# EAGLE design theWeather_A (EAGLE 5.11)

## Sheet 1 of 2
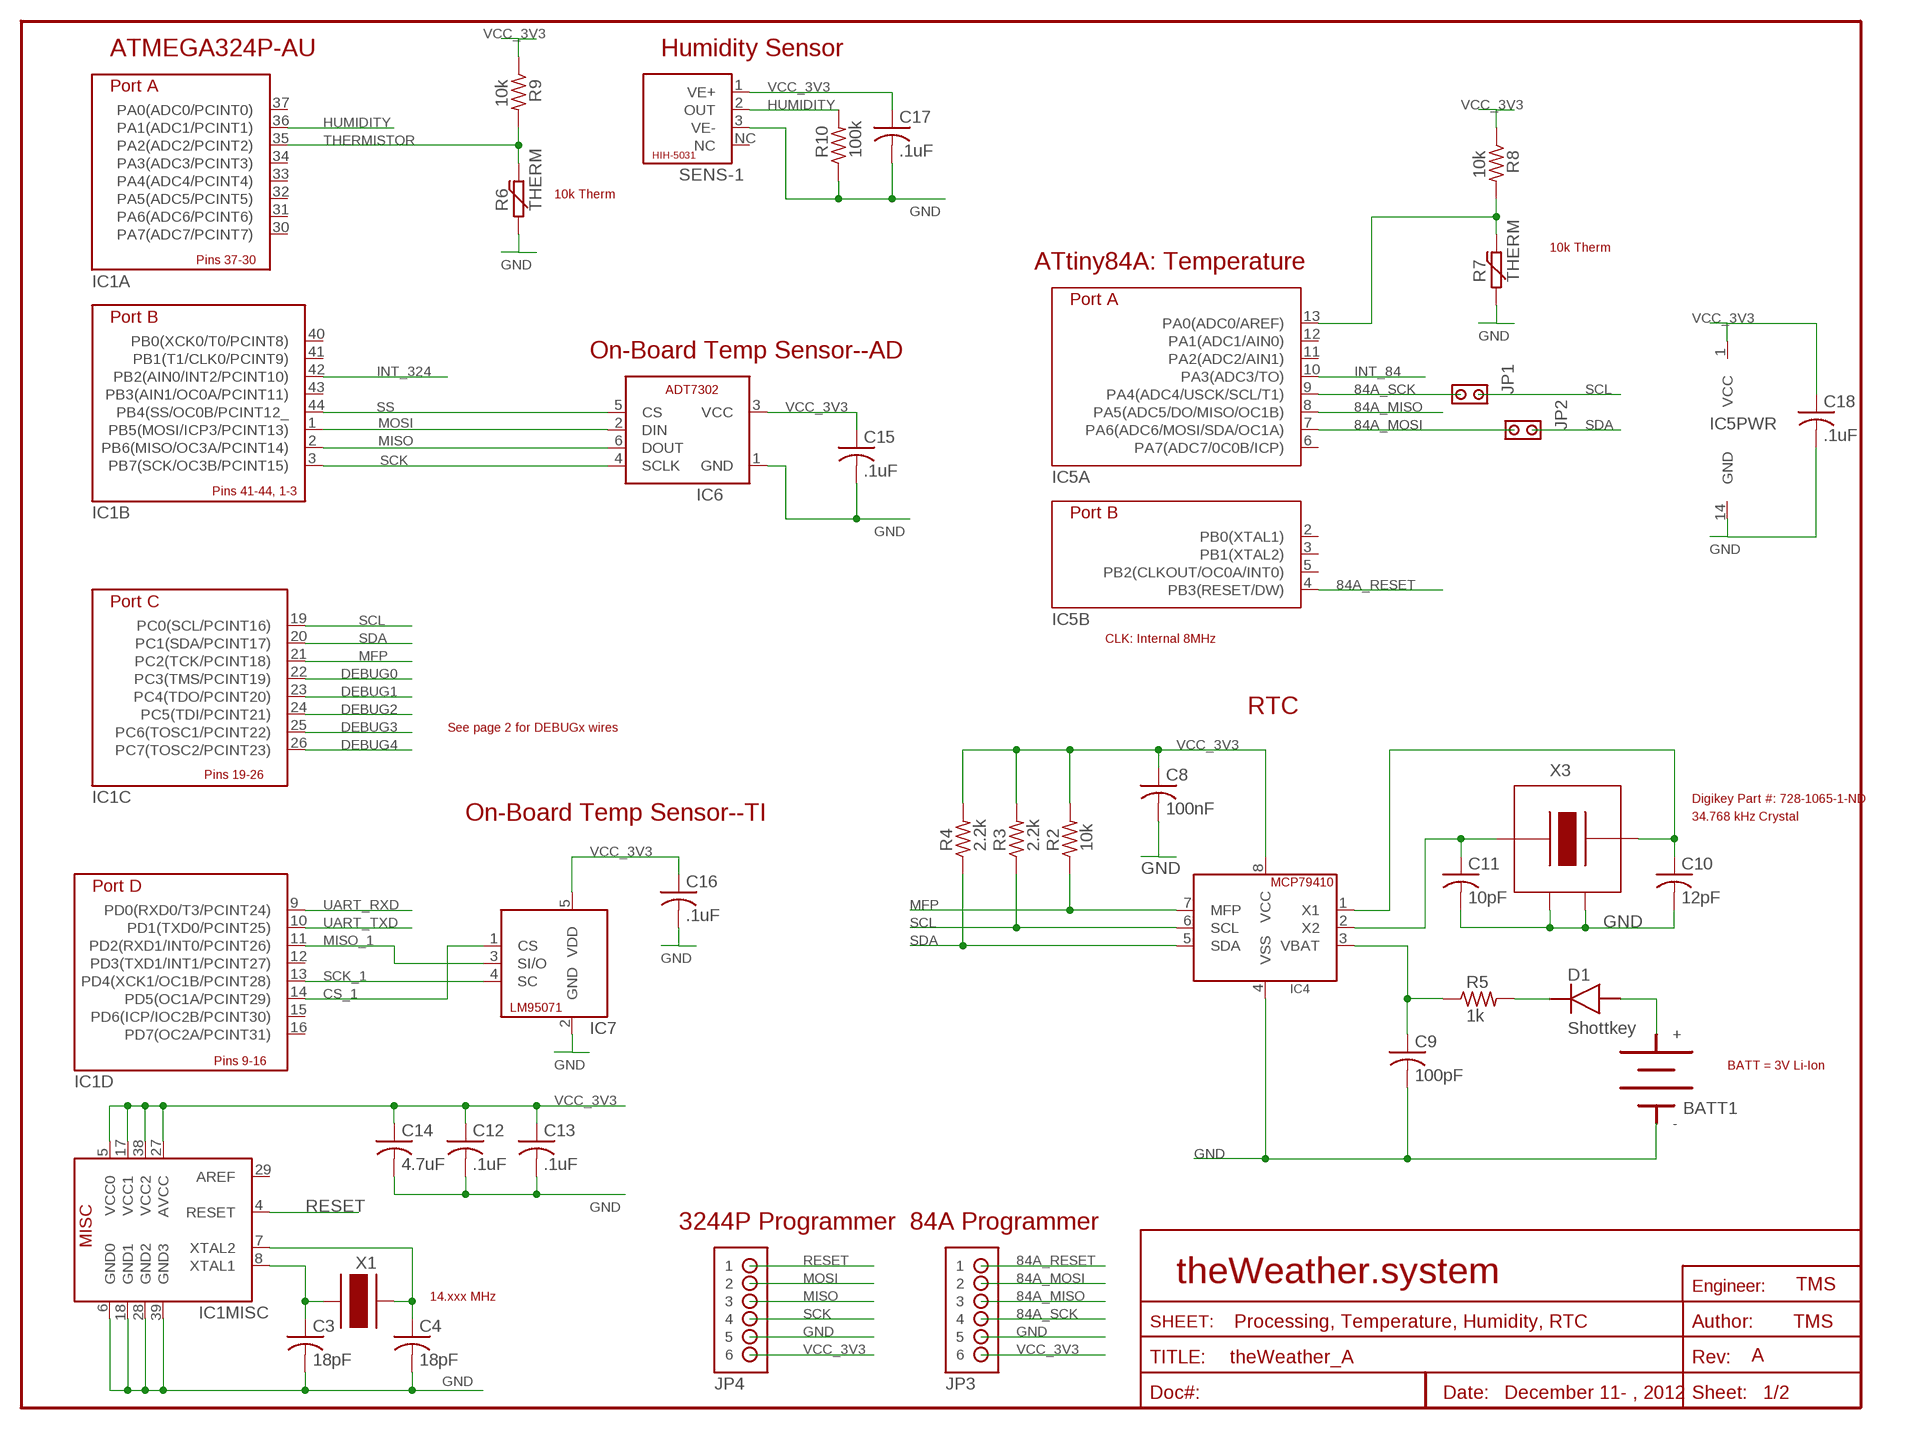
[diagram p0: schematic, sheet 1]

### Parts
BATT1  COINCELL-BR-1632A  [BR-1632A]
C3  18pF  CAP-S0805S  [C0805S]
C4  18pF  CAP-S0805S  [C0805S]
C8  100nF  CAP-S0603S  [C0603S]
C9  100pF  CAP-S0603  [C0603]
C10  12pF  CAP-S0603  [C0603]
C11  10pF  CAP-S0603  [C0603]
C12  .1uF  CAP-S0402  [C0402]
C13  .1uF  CAP-S0402  [C0402]
C14  4.7uF  CAP-S0603S  [C0603S]
C15  .1uF  CAP-S0402  [C0402]
C16  .1uF  CAP-S0402  [C0402]
C17  .1uF  CAP-S0402  [C0402]
C18  .1uF  CAP-S0402  [C0402]
D1  Shottkey  DIODE-DO-214AA  [DO-214AA]
IC1  ATMEGA1284P-AU  [TQFP44]
IC4  MCP79410-SOIC8  [SOIC8]
IC5  ATTINY24-SSU  [SOIC14]
IC6  ADT7302  [SOT23-6]
IC7  LM95071  [SOT23-5]
JP1  JPR-1X2  [JPR-1X2]
JP2  JPR-1X2  [JPR-1X2]
JP3  HDR-1X6-OFFSET  [HDR-1X6_OFFSET]
JP4  HDR-1X6-OFFSET  [HDR-1X6_OFFSET]
R2  10k  RES-S0402  [R0402]
R3  2.2k  RES-S0402  [R0402]
R4  2.2k  RES-S0402  [R0402]
R5  1k  RES-S0402  [R0402]
R6  THERM  [2-HOLE]
R7  THERM  [2-HOLE]
R8  10k  RES-S0402  [R0402]
R9  10k  RES-S0402  [R0402]
R10  100k  RES-S0402  [R0402]
SENS-1  HIH-5031  [HIH-5031]
X1  XTAL-TXC-7A  [TXC-7A-SERIES]
X3  SSPT7F-7PF20-R  [SSP-T7-FL]

### Nets
84A_MISO: IC5.8(A:PA5(ADC5/DO/MISO/OC1B)) JP3.3
84A_MOSI: IC5.7(A:PA6(ADC6/MOSI/SDA/OC1A)) JP2.1 JP3.2
84A_RESET: IC5.4(B:PB3(RESET/DW)) JP3.1
84A_SCK: IC5.9(A:PA4(ADC4/USCK/SCL/T1)) JP1.1 JP3.4
CS_1: IC1.14(D:PD5(OC1A/PCINT29)) IC7.1(CS)
DEBUG0: IC1.22(C:PC3(TMS/PCINT19)) ; also sheet 2
DEBUG1: IC1.23(C:PC4(TDO/PCINT20)) ; also sheet 2
DEBUG2: IC1.24(C:PC5(TDI/PCINT21)) ; also sheet 2
DEBUG3: IC1.25(C:PC6(TOSC1/PCINT22)) ; also sheet 2
DEBUG4: IC1.26(C:PC7(TOSC2/PCINT23)) ; also sheet 2
GND: BATT1.- C3.2 C4.2 C8.2 C9.2 C10.2 C11.2 C12.2 C13.2 C14.2 C15.2 C16.2 C17.2 C18.2 IC1.6(MISC:GND0) IC1.18(MISC:GND1) IC1.28(MISC:GND2) IC1.39(MISC:GND3) IC4.4(VSS) IC5.14(PWR:GND) IC6.1(GND) IC7.2(GND) JP3.5 JP4.5 R6.1 R7.1 R10.1 SENS-1.3(VE-) X3.2(G2) X3.3(G1) ; also sheet 2
HUMIDITY: IC1.36(A:PA1(ADC1/PCINT1)) R10.2 SENS-1.2(OUT)
INT_84: IC5.10(A:PA3(ADC3/TO)) ; also sheet 2
INT_324: IC1.42(B:PB2(AIN0/INT2/PCINT10)) ; also sheet 2
MFP: IC1.21(C:PC2(TCK/PCINT18)) IC4.7(MFP) R2.1
MISO: IC1.2(B:PB6(MISO/OC3A/PCINT14)) IC6.6(DOUT) JP4.3
MISO_1: IC1.11(D:PD2(RXD1/INT0/PCINT26)) IC7.3(SI/O)
MOSI: IC1.1(B:PB5(MOSI/ICP3/PCINT13)) IC6.2(DIN) JP4.2
N$3: C4.1 IC1.7(MISC:XTAL2) X1.P$1
N$6: C10.1 IC4.1(X1) X3.4
N$8: C3.1 IC1.8(MISC:XTAL1) X1.P$2
N$10: C9.1 IC4.3(VBAT) R5.1
N$11: BATT1.+ D1.ANODE(A)
N$12: D1.CATH(C) R5.2
N$13: IC5.13(A:PA0(ADC0/AREF)) R7.2 R8.2
N$23: C11.1 IC4.2(X2) X3.1
RESET: IC1.4(MISC:RESET) JP4.1
SCK: IC1.3(B:PB7(SCK/OC3B/PCINT15)) IC6.4(SCLK) JP4.4
SCK_1: IC1.13(D:PD4(XCK1/OC1B/PCINT28)) IC7.4(SC)
SCL: IC1.19(C:PC0(SCL/PCINT16)) IC4.6(SCL) JP1.2 R3.1 ; also sheet 2
SDA: IC1.20(C:PC1(SDA/PCINT17)) IC4.5(SDA) JP2.2 R4.1 ; also sheet 2
SS: IC1.44(B:PB4(SS/OC0B/PCINT12_) IC6.5(CS)
THERMISTOR: IC1.35(A:PA2(ADC2/PCINT2)) R6.2 R9.2
UART_RXD: IC1.9(D:PD0(RXD0/T3/PCINT24)) ; also sheet 2
UART_TXD: IC1.10(D:PD1(TXD0/PCINT25)) ; also sheet 2
VCC_3V3: C8.1 C12.1 C13.1 C14.1 C15.1 C16.1 C17.1 C18.1 IC1.5(MISC:VCC0) IC1.17(MISC:VCC1) IC1.27(MISC:AVCC) IC1.38(MISC:VCC2) IC4.8(VCC) IC5.1(PWR:VCC) IC6.3(VCC) IC7.5(VDD) JP3.6 JP4.6 R2.2 R3.2 R4.2 R8.1 R9.1 SENS-1.1(VE+) ; also sheet 2
Unconnected: IC1.12(D:PD3(TXD1/INT1/PCINT27)) IC1.15(D:PD6(ICP/IOC2B/PCINT30)) IC1.16(D:PD7(OC2A/PCINT31)) IC1.29(MISC:AREF) IC1.30(A:PA7(ADC7/PCINT7)) IC1.31(A:PA6(ADC6/PCINT6)) IC1.32(A:PA5(ADC5/PCINT5)) IC1.33(A:PA4(ADC4/PCINT4)) IC1.34(A:PA3(ADC3/PCINT3)) IC1.37(A:PA0(ADC0/PCINT0)) IC1.40(B:PB0(XCK0/T0/PCINT8)) IC1.41(B:PB1(T1/CLK0/PCINT9)) IC1.43(B:PB3(AIN1/OC0A/PCINT11)) IC5.2(B:PB0(XTAL1)) IC5.3(B:PB1(XTAL2)) IC5.5(B:PB2(CLKOUT/OC0A/INT0)) IC5.6(A:PA7(ADC7/0C0B/ICP)) IC5.11(A:PA2(ADC2/AIN1)) IC5.12(A:PA1(ADC1/AIN0)) SENS-1.NC

### Notes on the sheet
- ATMEGA324P-AU | Humidity Sensor
- 10k Therm
- 10k Therm
- ATtiny84A: Temperature
- On-Board Temp Sensor--AD
- CLK: Internal 8MHz
- RTC
- See page 2 for DEBUGx wires
- Digikey Part #: 728-1065-1-ND
- On-Board Temp Sensor--TI | 34.768 kHz Crystal
- BATT = 3V Li-Ion
- 3244P Programmer | 84A Programmer
- theWeather.system
- TMS
- 14.xxx MHz
- Processing, Temperature, Humidity, RTC | TMS
- A
- December 11- , 2012

## Sheet 2 of 2
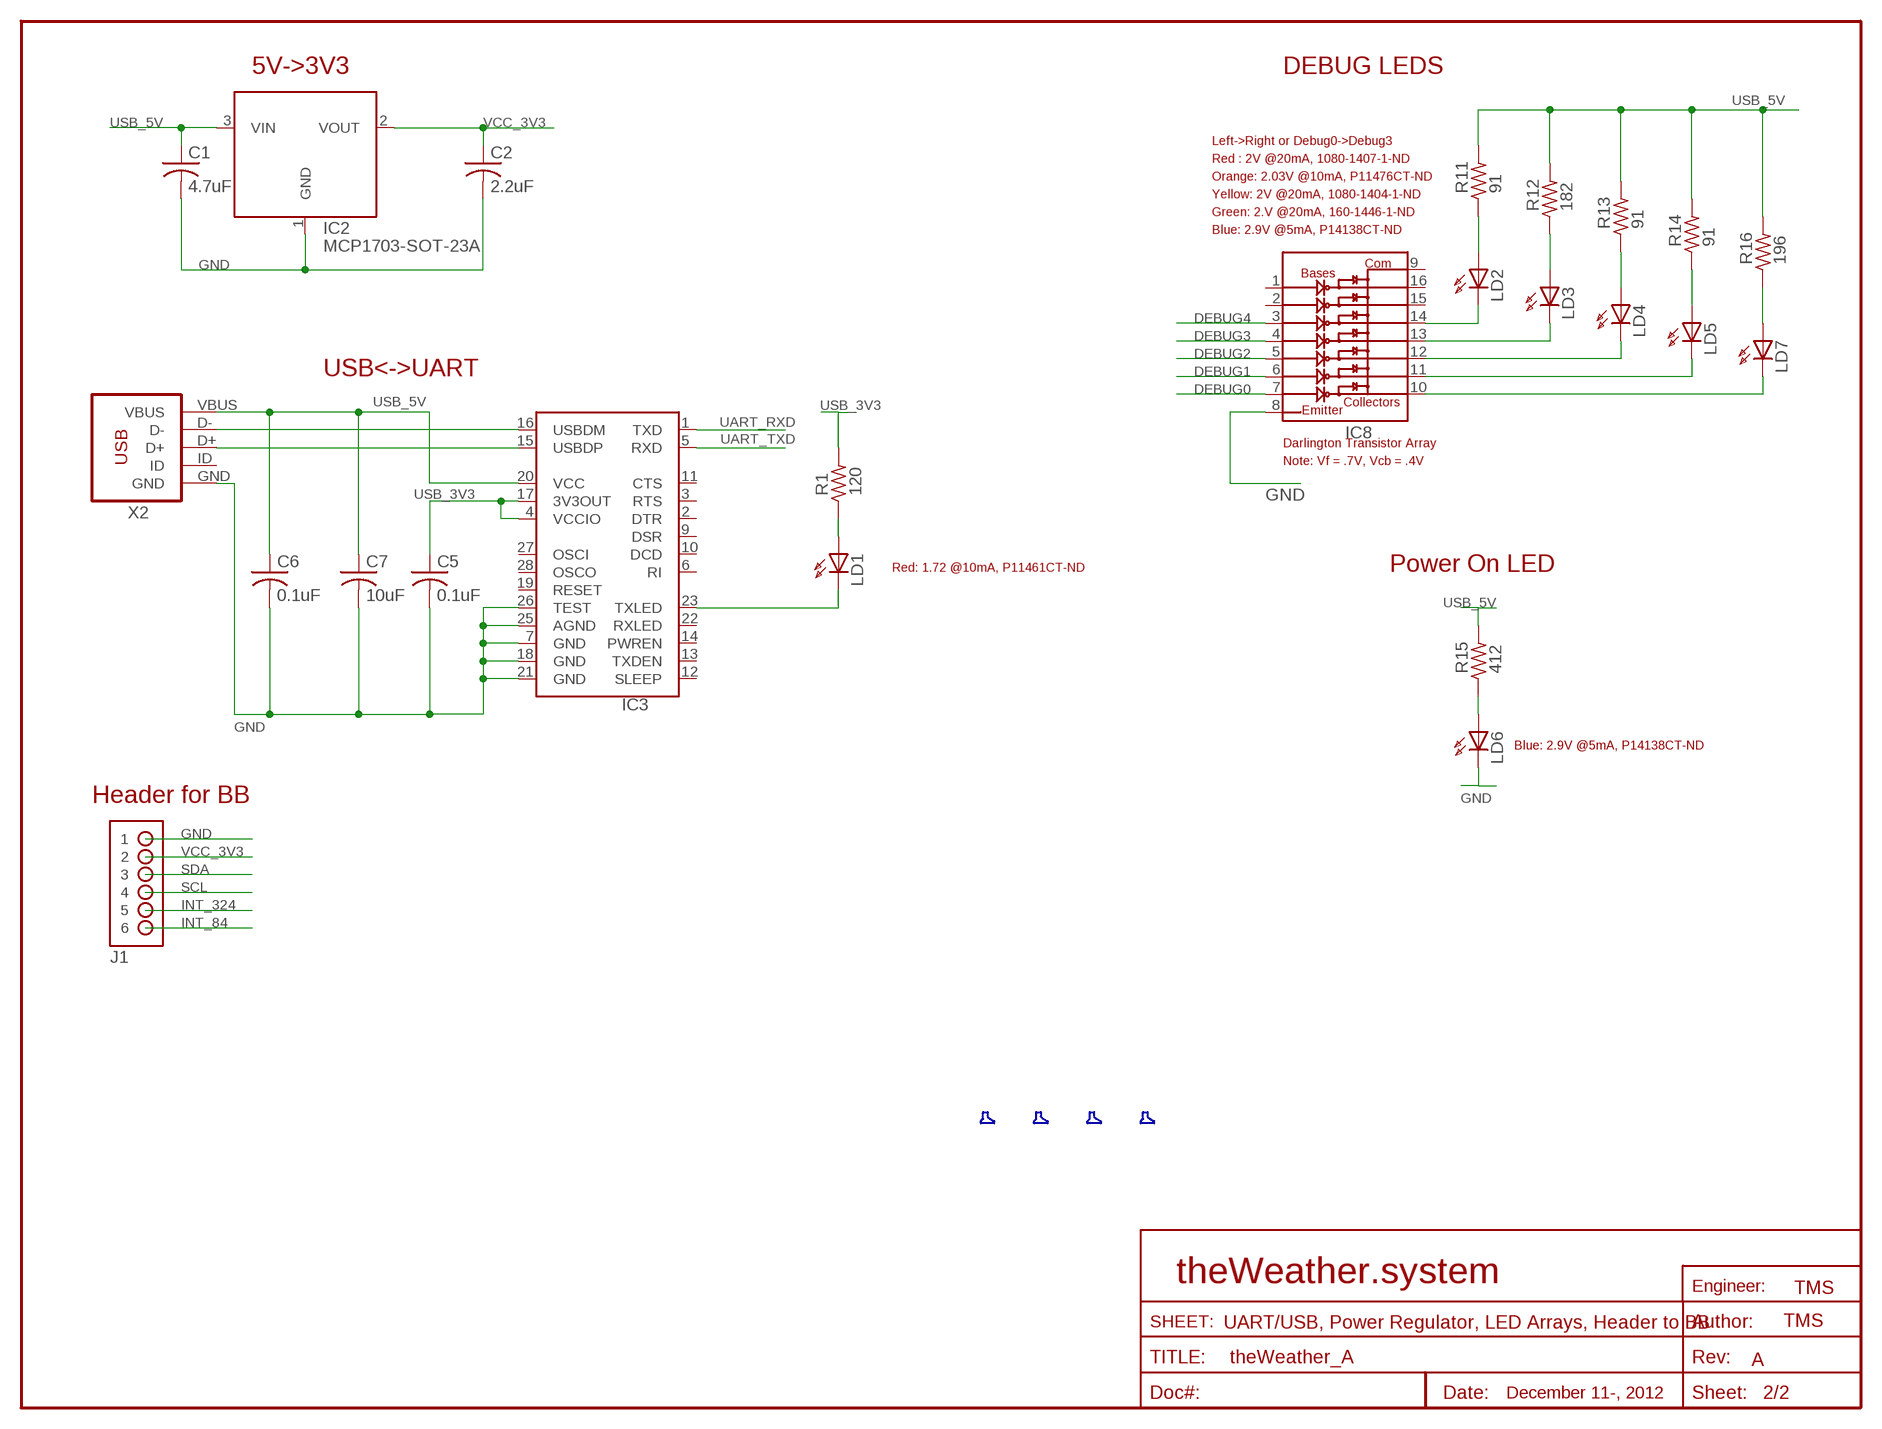
[diagram p1: schematic, sheet 2]

### Parts
C1  4.7uF  CAP-S0603S  [C0603S]
C2  2.2uF  CAP-S0603S  [C0603S]
C5  0.1uF  CAP-S0402P  [C0402P]
C6  0.1uF  CAP-S0402P  [C0402P]
C7  10uF  CAP-S0603S  [C0603S]
F1  FOOT  [FOOT#6]
F2  FOOT  [FOOT#6]
F3  FOOT  [FOOT#6]
F4  FOOT  [FOOT#6]
IC2  MCP1703-SOT-23A  [SOT-23A]
IC3  FT232R  [SSOP28L]
IC8  ULQ2004A-Q1-TSSOP-16  [TSSOP-16]
J1  HDR-2X3  [HDR-2X3]
LD1  LED-S0603  [D0603]
LD2  LED-S0603  [D0603]
LD3  LED-S0603  [D0603]
LD4  LED-S0603  [D0603]
LD5  LED-S0603  [D0603]
LD6  LED-S0603  [D0603]
LD7  LED-S0603  [D0603]
R1  120  RES-S0402  [R0402]
R11  91  RES-S0402  [R0402]
R12  182  RES-S0402  [R0402]
R13  91  RES-S0402  [R0402]
R14  91  RES-S0402  [R0402]
R15  412  RES-S0402  [R0402]
R16  196  RES-S0402  [R0402]
X2  USB-MINI-B-OTG-MOLEX_67503-1020  [USB-MINI-B-OTG]

### Nets
DEBUG0: IC8.7 ; also sheet 1
DEBUG1: IC8.6 ; also sheet 1
DEBUG2: IC8.5 ; also sheet 1
DEBUG3: IC8.4 ; also sheet 1
DEBUG4: IC8.3 ; also sheet 1
GND: C1.2 C2.2 C5.2 C6.2 C7.2 IC2.1(GND) IC3.7(GND) IC3.18(GND) IC3.21(GND) IC3.25(AGND) IC3.26(TEST) IC8.8 J1.1 LD6.C X2.GND ; also sheet 1
INT_84: J1.6 ; also sheet 1
INT_324: J1.5 ; also sheet 1
N$2: IC3.16(USBDM) X2.D-
N$4: LD1.A R1.1
N$5: IC3.15(USBDP) X2.D+
N$9: IC3.23(TXLED) LD1.C
N$14: LD2.A R11.1
N$15: LD3.A R12.1
N$16: LD4.A R13.1
N$17: LD5.A R14.1
N$18: IC8.14 LD2.C
N$19: LD6.A R15.1
N$20: IC8.13 LD3.C
N$21: IC8.12 LD4.C
N$22: IC8.11 LD5.C
N$24: IC8.10 LD7.C
N$25: LD7.A R16.1
SCL: J1.4 ; also sheet 1
SDA: J1.3 ; also sheet 1
UART_RXD: IC3.1(TXD) ; also sheet 1
UART_TXD: IC3.5(RXD) ; also sheet 1
USB_3V3: C5.1 IC3.4(VCCIO) IC3.17(3V3OUT) R1.2
USB_5V: C1.1 C6.1 C7.1 IC2.3(VIN) IC3.20(VCC) R11.2 R12.2 R13.2 R14.2 R15.2 R16.2 X2.VBUS
VCC_3V3: C2.1 IC2.2(VOUT) J1.2 ; also sheet 1
Unconnected: IC3.2(DTR) IC3.3(RTS) IC3.6(RI) IC3.9(DSR) IC3.10(DCD) IC3.11(CTS) IC3.12(SLEEP) IC3.13(TXDEN) IC3.14(PWREN) IC3.19(RESET) IC3.22(RXLED) IC3.27(OSCI) IC3.28(OSCO) IC8.1 IC8.2 IC8.9 IC8.15 IC8.16 X2.ID

### Notes on the sheet
- 5V->3V3 | DEBUG LEDS
- Left->Right or Debug0->Debug3
- Red : 2V @20mA, 1080-1407-1-ND
- Orange: 2.03V @10mA, P11476CT-ND
- Yellow: 2V @20mA, 1080-1404-1-ND
- Green: 2.V @20mA, 160-1446-1-ND
- Blue: 2.9V @5mA, P14138CT-ND
- USB<->UART
- Darlington Transistor Array
- Note: Vf = .7V, Vcb = .4V
- Red: 1.72 @10mA, P11461CT-ND | Power On LED
- Blue: 2.9V @5mA, P14138CT-ND
- Header for BB
- theWeather.system
- TMS
- UART/USB, Power Regulator, LED Arrays, Header to BB | TMS
- A
- December 11-, 2012

## Library data of the parts
BATT1 = Mechanical:COINCELL
C1-C18 = Discrete:CAP: Capacitor
D1 = Discrete:DIODE: Diode
F1-F4 = Mechanical:FOOT: Foot (ie. #6 screw, or Rubber)
IC1 = Atmel:ATMEGA1284P-AU: Atmega1284P-AU, TQFP44 Package, Digikey: ATMEGA1284P-AURCT-ND, 128kb Flash, 3 SPI, 2 USART, 1 I2C
IC2 = Microchip:MCP1703: Digi-Key Part Number MCP1703T-3302E/CBCT-ND Manufacturer Microchip Technology Manufacturer Part Number MCP1703T-3302E/CB Description IC REG LDO 3.3V 250MA SOT-23A
IC3 = IC:FT232R: The FT232R is a USB to serial UART interface with the following advanced features: Data transfer rates from 300 baud to 3 Mbaud (RS422, RS485, RS232 ) at TTL levels. 128 byte receive buffer and 256 byte transmit buffer utilising buffer smoothing technology to allow for high data throughput. FTDI?s royalty-free Virtual Com Port (VCP) and Direct (D2XX) drivers eliminate the requirement
IC4 = IC:MCP79410: Digi-Key Part Number MCP79410-I/SN-ND Manufacturer Part Number MCP79410-I/SN Description IC RTC ALARM NVSRAM 8SOIC Microchip MCP79410 The MCP7941X series of low-power Real-Time Clocks (RTC) uses digital timing compensation for an accurate clock/calendar, a programmable output control for versatility, a power sense circuit that automatically switches to the backup supply, and nonvolatile memory for data storage. Using a low-cost 32.768 kHz crystal, it tracks time using several internal registers. For communication, the MCP7941X uses the I2C? bus.
IC5 = Atmel:ATTINY24: ATtiny24-44-84 AVR Microcontroller
IC6 = IC:ADT7302: Analog Devices Digital Thermometer, Digikey Part Number: ADT7302ARTZ-REEL7CT-ND, Takes ADC reading and then talks via 3/4 wire SPI to a uC
IC7 = TI:LM95071: Texas Instruments Temperature Sensor, Digikey Part Number: LM95071CIMF/NOPBCT-ND
IC8 = Discrete:ULQ2004A-Q1: Digi-Key Part Number 296-27409-1-ND Manufacturer Texas Instruments Manufacturer Part Number ULQ2003ATPWRQ1 Description IC DARLINGTN TRANS ARRAY 16TSSOP The ULQ2003A and ULQ2004A are high-voltage high-current Darlington transistor arrays. Each consists of seven npn Darlington pairs that feature high-voltage outputs with common-cathode clamp diodes for switching inductive loads. The collector-current rating of a single Darlington pair is 500 mA. The Darlington pairs can be paralleled for higher current capability. Applications include relay drivers, hammer drivers, lamp drivers, display drivers (LED and gas discharge), line drivers, and logic buffers.
J1 = Mechanical:HDR-2X3
JP1 JP2 = Mechanical:JPR-1X2
JP3 JP4 = Mechanical:HDR-1X6-OFFSET: 42 mil hole pattern with 16mil offset for jtag connector
LD1-LD7 = Discrete:LED: Discrete LED
R1-R5 R8-R16 = Discrete:RES: Resistor
R6 R7 = Discrete:THERM: Standard Thermistor. 2-Hole Digikey Part # 615-1083-ND
SENS-1 = Misc:HIH-5031: Honeywell Humidity Sensor, Manufacture Part #: HIH-5031, Digikey Part #: 480-3294-2-ND
X1 = Discrete:XTAL: Quartz Crystal
X2 = Mechanical:USB-MINI-B-OTG: Molex 67503-1020 USB mini B connector with through hole anchors.
X3 = Discrete:SSPT7F-7PF20-R

## Board
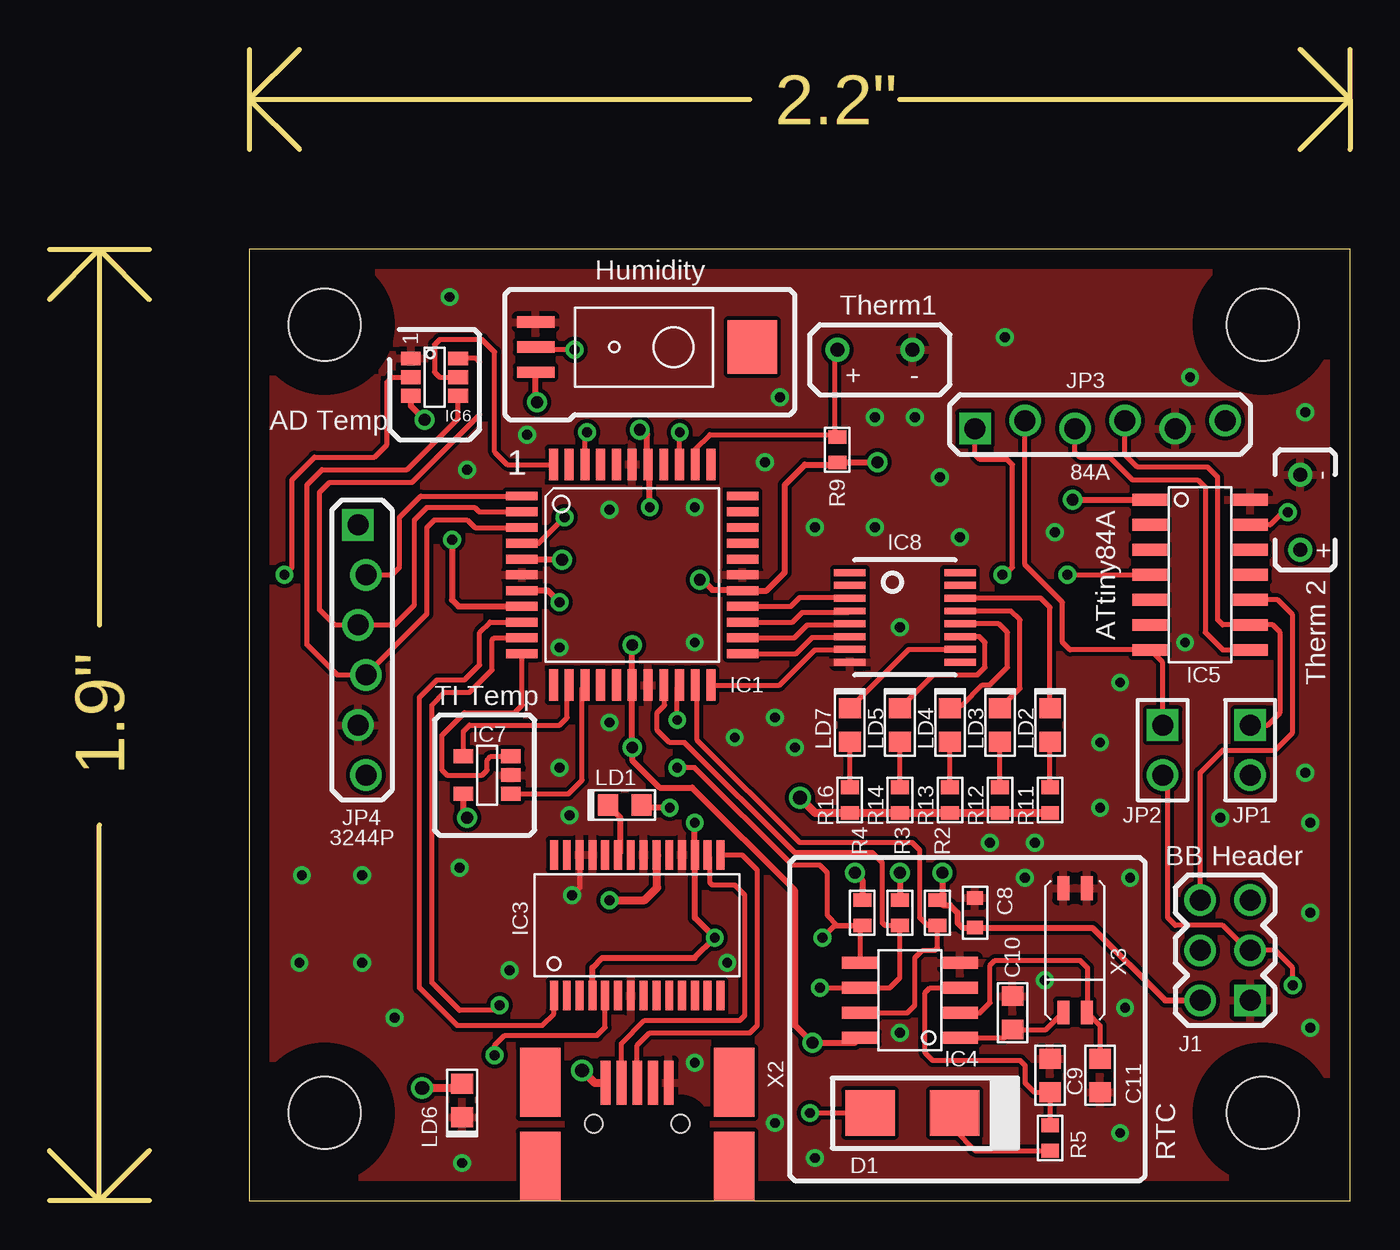
[diagram p2: board, top side]
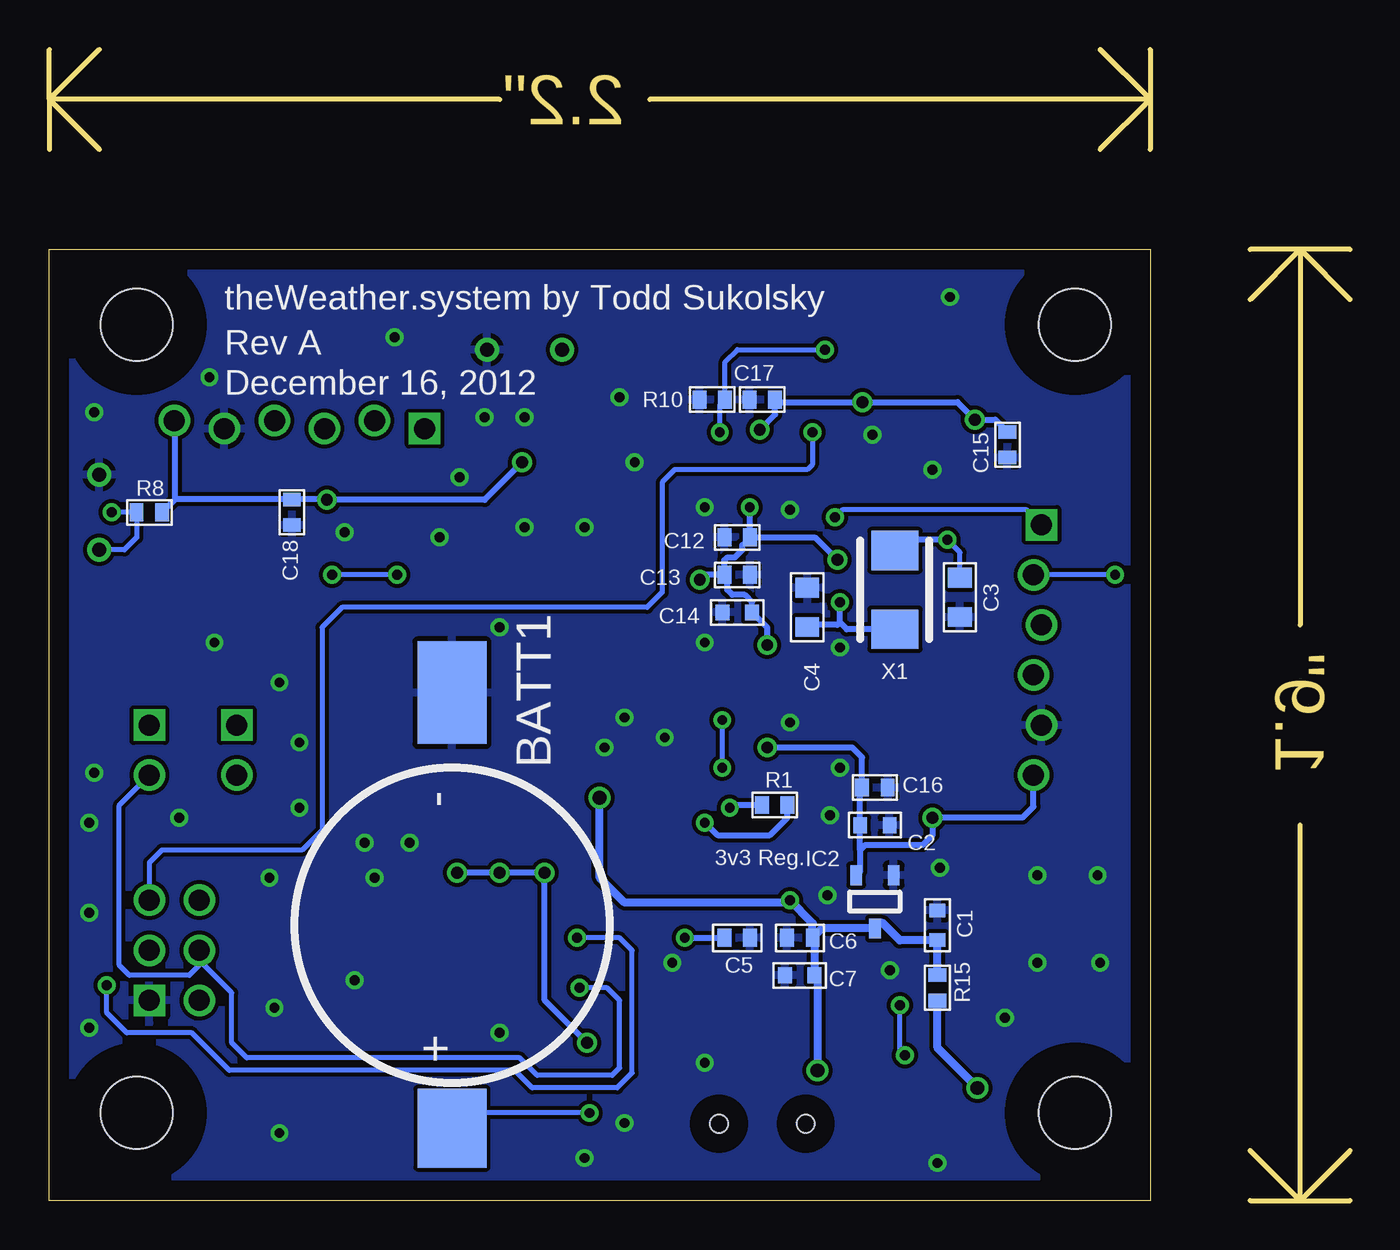
[diagram p3: board, bottom side, seen from below]

Size 66.04 x 58.42 mm. Coordinates in mm from the lower left corner, seen from the top.
Outline: 0,48.26 2.54,48.26
Outline: 2.54,48.26 5.08,48.26
Outline: 2.54,48.26 5.08,45.72
Outline: 2.54,48.26 0,45.72
Outline: 2.54,48.26 2.54,29.21
Outline: 5.08,0 2.54,0
Outline: 2.54,0 0,0
Outline: 2.54,0 5.08,2.54
Outline: 2.54,0 0,2.54
Outline: 2.54,0 2.54,19.05
Outline: 10.16,58.42 10.16,55.88
Outline: 10.16,55.88 10.16,53.34
Outline: 10.16,55.88 12.7,53.34
Outline: 10.16,55.88 12.7,58.42
Outline: 10.16,55.88 35.56,55.88
Outline: 43.18,55.88 66.04,55.88
Outline: 66.04,55.88 66.04,58.42
Outline: 66.04,55.88 66.04,53.34
Outline: 66.04,55.88 63.5,53.34
Outline: 66.04,55.88 63.5,58.42
Outline: 10.16,0 66.04,0 66.04,48.26 10.16,48.26 10.16,0
Copper layers (1*16): Top 0.035mm / dielectric 1.5mm / Bottom 0.035mm
Design rules "default": minimum track width 10mil, minimum drill 0.6mm, track to track 8mil, track to pad 8mil, pad to pad 8mil, via to via 8mil, smd to smd 8mil, copper to edge 40mil, drill to drill 8mil, minimum pad ring 10mil, minimum via ring 8mil, stop-mask expansion 4mil, vias tented up to drill 0mil, thermal gap 10mil

### Footprints (pad centres in the part's own frame; a part is rotated, then mirrored left to right if it is on the bottom)
BR-1632A = smd 4 x 3.5: + -10.3,0 | smd 5.2 x 3.5: - 11.8,0
C0603S = smd 0.7 x 0.8: 1 -0.75,0; 2 0.75,0
C0805S = smd 1 x 1.2: 1 -1,0; 2 1,0
C0402P = smd 0.7 x 0.9: 1 -0.65,0; 2 0.65,0
C0603 = smd 1 x 1.1: 1 -0.85,0; 2 0.85,0
C0402 = smd 0.7 x 0.9: 1 -0.65,0; 2 0.65,0
DO-214AA = smd 2.5 x 2.3: ANODE -2.15,0; CATH 2.15,0
FOOT#6 = hole 3.658: 0,0
TQFP44 = smd 1.6 x 0.45: 1 -5.6,4; 2 -5.6,3.2; 3 -5.6,2.4; 4 -5.6,1.6; 5 -5.6,0.8; 6 -5.6,0; 7 -5.6,-0.8; 8 -5.6,-1.6; 9 -5.6,-2.4; 10 -5.6,-3.2; 11 -5.6,-4; 23 5.6,-4; 24 5.6,-3.2; 25 5.6,-2.4; 26 5.6,-1.6; 27 5.6,-0.8; 28 5.6,0; 29 5.6,0.8; 30 5.6,1.6; 31 5.6,2.4; 32 5.6,3.2; 33 5.6,4 | smd 0.45 x 1.6: 12 -4,-5.6; 13 -3.2,-5.6; 14 -2.4,-5.6; 15 -1.6,-5.6; 16 -0.8,-5.6; 17 0,-5.6; 18 0.8,-5.6; 19 1.6,-5.6; 20 2.4,-5.6; 21 3.2,-5.6; 22 4,-5.6; 34 4,5.6; 35 3.2,5.6; 36 2.4,5.6; 37 1.6,5.6; 38 0.8,5.6; 39 0,5.6; 40 -0.8,5.6; 41 -1.6,5.6; 42 -2.4,5.6; 43 -3.2,5.6; 44 -4,5.6
SOT-23A = smd 0.6 x 1: 1 -0.95,0; 2 0.95,0; 3 0,2.7
SSOP28L = smd 0.4 x 1.5: 1 -4.225,-3.575; 2 -3.575,-3.575; 3 -2.925,-3.575; 4 -2.275,-3.575; 5 -1.625,-3.575; 6 -0.975,-3.575; 7 -0.325,-3.575; 8 0.325,-3.575; 9 0.975,-3.575; 10 1.625,-3.575; 11 2.275,-3.575; 12 2.925,-3.575; 13 3.575,-3.575; 14 4.225,-3.575; 15 4.225,3.575; 16 3.575,3.575; 17 2.925,3.575; 18 2.275,3.575; 19 1.625,3.575; 20 0.975,3.575; 21 0.325,3.575; 22 -0.325,3.575; 23 -0.975,3.575; 24 -1.625,3.575; 25 -2.275,3.575; 26 -2.925,3.575; 27 -3.575,3.575; 28 -4.225,3.575
SOIC8 = smd 0.6 x 1.8: 1 -1.905,-2.54; 2 -0.635,-2.54; 3 0.635,-2.54; 4 1.905,-2.54; 5 1.905,2.54; 6 0.635,2.54; 7 -0.635,2.54; 8 -1.905,2.54
SOIC14 = smd 0.6 x 1.8: 1 -3.81,-2.54; 2 -2.54,-2.54; 3 -1.27,-2.54; 4 0,-2.54; 5 1.27,-2.54; 6 2.54,-2.54; 7 3.81,-2.54; 8 3.81,2.54; 9 2.54,2.54; 10 1.27,2.54; 11 0,2.54; 12 -1.27,2.54; 13 -2.54,2.54; 14 -3.81,2.54
SOT23-6 = smd 0.7 x 1: 1 -0.95,-1.2; 2 0,-1.2; 3 0.95,-1.2; 4 0.95,1.2; 5 0,1.2; 6 -0.95,1.2
SOT23-5 = smd 0.7 x 1: 1 -0.95,-1.2; 2 0,-1.2; 3 0.95,-1.2; 4 0.95,1.2; 5 -0.95,1.2
TSSOP-16 = smd 0.35 x 1.6: 1 -2.275,-2.8; 2 -1.625,-2.8; 3 -0.975,-2.8; 4 -0.325,-2.8; 5 0.325,-2.8; 6 0.975,-2.8; 7 1.625,-2.8; 8 2.275,-2.8; 9 2.275,2.8; 10 1.625,2.8; 11 0.975,2.8; 12 0.325,2.8; 13 -0.325,2.8; 14 -0.975,2.8; 15 -1.625,2.8; 16 -2.275,2.8
HDR-2X3 = drill 1.067 square: 1 -1.27,2.54 | drill 1.067 round: 2 1.27,2.54; 3 -1.27,0; 4 1.27,0; 5 -1.27,-2.54; 6 1.27,-2.54
JPR-1X2 = drill 1.067 square: 1 0,1.27 | drill 1.067 round: 2 0,-1.27
HDR-1X6_OFFSET = drill 1.067 square: 1 -0.203,6.35 | drill 1.067 round: 2 0.203,3.81; 3 -0.203,1.27; 4 0.203,-1.27; 5 -0.203,-3.81; 6 0.203,-6.35
D0603 = smd 1 x 1.1: A 0.85,0; C -0.85,0
R0402 = smd 0.7 x 0.9: 1 -0.65,0; 2 0.65,0
2-HOLE = drill 0.7 round: 1 -1.905,0; 2 1.905,0
HIH-5031 = smd 0.57 x 1.9: 1 1.27,-11; 2 0,-11; 3 -1.27,-11 | smd 2.7 x 2.5: NC 0,0
TXC-7A-SERIES = smd 2 x 2.4: P$1 -2,0; P$2 2,0
USB-MINI-B-OTG = smd 2.25 x 0.5: D+ 5.975,0; D- 5.975,0.8; GND 5.975,-1.6; ID 5.975,-0.8; VBUS 5.975,1.6 | smd 3.5 x 2.05: SHLD1 1.75,4.925; SHLD2 6,4.925; SHLD3 1.75,-4.925; SHLD4 6,-4.925 | hole 0.9: 3.9,2.2; 3.9,-2.2
SSP-T7-FL = smd 1.2 x 0.6: 1 -3.15,-0.6; 2 3.15,-0.6; 3 3.15,0.6; 4 -3.15,0.6

### Placement (x,y rotation side)
BATT1  45.59,13.97 90 bottom
C1  20.95,13.97 90 bottom
C2  24.13,19.05 0 bottom
C3  19.81,30.61 270 bottom
C4  27.56,30.1 90 bottom
C5  31.11,13.34 0 bottom
C6  27.94,13.34 180 bottom
C7  27.94,11.43 180 bottom
C8  46.99,14.61 90 top
C9  50.8,6.35 90 top
C10  48.89,9.53 90 top
C11  53.34,6.35 270 top
C12  31.11,33.66 180 bottom
C13  31.11,31.75 0 bottom
C14  31.11,29.84 180 bottom
C15  17.4,38.35 270 bottom
C16  24.13,20.95 0 bottom
C17  29.84,40.64 180 bottom
C18  53.72,34.92 270 bottom
D1  43.81,4.45 0 top
F1  61.59,4.45 0 top
F2  13.97,4.45 0 top
F3  13.97,44.45 0 top
F4  61.59,44.45 0 top
IC1  29.59,31.75 0 top
IC2  24.13,16.51 180 bottom
IC3  29.84,13.97 0 top
IC4  43.69,10.16 90 top
IC5  58.42,31.75 270 top
IC6  19.56,41.78 270 top
IC7  22.23,21.59 90 top
IC8  43.43,29.59 270 top
J1  59.69,12.7 180 top
JP1  60.96,22.86 0 top
JP2  56.52,22.86 0 top
JP3  53.34,39.37 90 top
JP4  15.88,27.94 0 top
LD1  29.21,20.07 0 top
LD2  50.8,24.13 270 top
LD3  48.26,24.13 270 top
LD4  45.72,24.13 270 top
LD5  43.18,24.13 270 top
LD6  20.95,5.08 90 top
LD7  40.64,24.13 270 top
R1  29.21,20.07 0 bottom
R2  45.08,14.61 90 top
R3  43.18,14.61 90 top
R4  41.27,14.61 90 top
R5  50.8,3.17 270 top
R6  41.91,43.18 180 top
R7  63.5,34.92 270 top
R8  60.96,34.92 180 bottom
R9  40,38.1 90 top
R10  32.39,40.64 0 bottom
R11  50.8,20.32 270 top
R12  48.26,20.32 270 top
R13  45.72,20.32 270 top
R14  43.18,20.32 270 top
R15  20.95,10.79 90 bottom
R16  40.64,20.32 270 top
SENS-1  35.69,43.31 270 top
X1  23.11,30.99 90 bottom
X2  29.84,0 90 top
X3  52.07,12.7 90 top

### Tracks (layer width: path | path; a pad name or v marks a point on that pad's centre or on a via)
84A_MISO
  Top 0.254: IC5.8 59.56,27.94 58.67,28.83 58.67,36.2 58.29,36.58 54.99,36.58 53.85,37.72 52.32,37.72 52.07,37.97 JP3.3
84A_MOSI
  Top 0.254: JP2.1 56.52,27.3 IC5.7 51.82,27.94 51.44,28.32 51.44,30.35 49.53,32.26 JP3.2
84A_RESET  (via drill 0.5)
  Top 0.254: v51.69,31.75 IC5.4 | v48.39,31.75 48.51,31.75 48.89,32.13 48.89,37.34 48.64,37.59 47.24,37.59 46.99,37.85 JP3.1
  Bottom 0.254: v48.39,31.75 v51.69,31.75
84A_SCK
  Top 0.254: JP1.1 61.85,24.13 62.48,24.77 62.48,28.83 62.1,29.21 IC5.9 59.56,29.21 59.31,29.46 59.31,36.7 58.8,37.21 55.25,37.21 54.61,37.85 JP3.4
CS_1
  Top 0.254: IC7.1 26.36,20.64 27.05,21.34 27.05,26.01 IC1.14
DEBUG0
  Top 0.254: IC1.22 37.07,26.15 38.86,27.94 40.61,27.94 IC8.7
DEBUG1
  Top 0.254: IC1.23 37.91,27.75 38.73,28.57 40.59,28.57 IC8.6
DEBUG2
  Top 0.254: IC1.24 37.82,28.55 38.48,29.21 40.58,29.21 IC8.5
DEBUG3
  Top 0.254: IC1.25 37.73,29.35 38.23,29.84 40.56,29.84 IC8.4
DEBUG4
  Top 0.254: IC1.26 37.64,30.15 38.1,30.61 40.59,30.61 IC8.3
GND  (via drill 0.5)
  Top 0.254: IC3.26 26.92,15.87 v26.54,15.49
  other vias: 32.77,6.99 25.91,21.97 26.42,19.56 17.53,9.27 34.42,12.06 50.55,11.18 20.83,16.89 23.37,11.68 21.21,37.08 24.26,38.86 28.45,35.05 12.83,16.51 15.88,16.51 12.7,12.06 15.88,12.06 20.95,1.91 28.45,24.26 34.8,23.5 36.83,24.51 37.85,22.99 32.77,28.32 25.91,28.07 32.77,35.18 38.86,34.16 41.91,34.16 43.18,29.08 46.23,33.66 54.36,26.29 51.05,33.91 45.21,36.7 43.94,39.75 36.32,37.47 37.08,40.77 20.32,45.85 48.51,43.81 41.91,39.75 57.91,41.78 63.75,40.01 57.66,28.32 53.34,23.24 63.75,21.72 59.44,19.43 53.34,19.94 47.75,18.16 50.04,18.16 49.53,16.38 54.86,16.38 54.61,9.78 54.36,3.43 38.86,2.16 43.18,8.51 36.83,3.94 64.01,8.76 64.01,14.61 64.01,19.18
  pour Bottom: 10.16,48.26 66.04,48.26 66.04,0 10.16,0
  pour Top: 10.16,48.26 66.04,48.26 66.04,0 10.16,0
HUMIDITY  (via drill 0.5)
  Top 0.254: IC1.36 31.99,38.98 v32,38.99 | v26.67,43.18 24.81,43.18 SENS-1.2
  Bottom 0.254: v32,38.99 32,40.37 R10.2 31.73,42.56 31.11,43.18 v26.67,43.18
INT_84
  Top 0.254: J1.6 58.42,21.72 59.56,22.86 62.23,22.86 63.12,23.75 63.12,29.72 62.36,30.48 IC5.10
INT_324  (via drill 0.5)
  Top 0.254: IC1.42 27.19,38.88 v27.3,38.99
  Bottom 0.254: v27.3,38.99 27.3,37.34 27.56,37.08 34.29,37.08 34.92,36.45 34.92,30.86 35.69,30.1 51.18,30.1 52.2,29.08 52.2,18.8 53.21,17.78 60.33,17.78 60.96,17.14 J1.5
MFP
  Top 0.254: IC4.7 43.56,9.53 43.94,9.91 43.94,12.32 44.32,12.7 44.96,12.7 45.08,12.83 R2.1 44.59,13.96 44.2,14.35 44.2,17.78 43.81,18.16 38.1,18.16 32.89,23.37 32.89,26.05 IC1.21
MISO
  Top 0.254: IC1.2 21.82,34.95 21.59,35.18 19.18,35.18 18.54,34.54 18.54,30.23 17.53,29.21 JP4.3 14.48,29.21 13.72,29.97 13.72,35.94 14.22,36.45 18.41,36.45 21.84,39.88 21.84,42.55 21.66,42.73 IC6.6
MISO_1
  Top 0.254: IC7.3 22.41,22.54 22.23,22.35 22.23,21.84 21.97,21.59 20.19,21.59 19.94,21.84 19.94,23.62 21.08,24.77 23.62,24.77 24,25.15 24,27.74 IC1.11
MOSI  (via drill 0.5)
  Top 0.254: IC1.1 18.86,35.75 17.78,34.67 17.78,32.13 17.4,31.75 JP4.2 | IC6.2 17.4,41.78 17.14,41.53 17.14,38.35 16.51,37.72 13.46,37.72 12.32,36.58 12.32,32.13 v11.94,31.75
  Bottom 0.254: v11.94,31.75 JP4.2
N$2
  Top 0.254: X2.D- 29.05,7.96 30.23,9.14 35.05,9.14 35.31,9.4 35.31,15.49 34.8,16 33.66,16 33.53,16.13 33.53,17.44 IC3.16
N$3  (via drill 0.5)
  Top 0.305: IC1.7 25.31,30.95 v25.91,30.35
  Bottom 0.305: 25.91,29.34 v25.91,30.35 | 25.91,29.34 26.04,29.21 27.45,29.21 C4.1 | X1.P$1 25.56,28.99 25.91,29.34
N$4  (via drill 0.5)
  Top 0.305: v31.5,19.94 30.19,19.94 LD1.A
  Bottom 0.305: R1.1 31.37,20.07 v31.5,19.94
N$5
  Top 0.254: X2.D+ 29.84,7.87 30.48,8.51 35.56,8.51 35.94,8.89 35.94,16.76 35.18,17.53 34.09,17.53 IC3.15
N$6
  Top 0.254: IC4.1 48.47,8.26 C10.1 50.59,8.68 X3.4
N$8  (via drill 0.5)
  Top 0.305: IC1.8 20.78,30.15 20.45,30.48 v20.45,33.53
  Bottom 0.254: C3.1 19.81,32.89 v20.45,33.53
  Bottom 0.305: v20.45,33.53 22.57,33.53 X1.P$2
N$9
  Top 0.305: IC3.23 29,17.67 29,19.43 LD1.C
N$10
  Top 0.254: R5.1 C9.1 50,5.5 49.53,5.97 49.53,6.86 49.28,7.11 44.83,7.11 44.45,7.49 44.45,10.54 44.7,10.79 IC4.3
N$11  (via drill 0.5)
  Top 0.254: v38.61,4.45 D1.ANODE
  Bottom 0.254: v38.61,4.45 44.82,4.45 BATT1.+
N$12
  Top 0.254: D1.CATH 45.97,3.56 46.99,2.54 50.78,2.54 R5.2
N$13  (via drill 0.5)
  Top 0.254: v62.86,34.92 62.61,34.92 61.98,34.29 IC5.13
  Bottom 0.254: v62.86,34.92 R8.2 61.59,34.91 61.59,33.66 62.23,33.02 R7.2
N$14
  Top 0.254: R11.1 LD2.A
N$15
  Top 0.254: R12.1 LD3.A
N$16
  Top 0.254: R13.1 LD4.A
N$17
  Top 0.254: R14.1 LD5.A
N$18
  Top 0.254: IC8.14 50.33,30.57 50.8,30.1 LD2.C
N$19  (via drill 0.7)
  Top 0.406: v18.92,5.71 20.74,5.71 LD6.A
  Bottom 0.406: R15.1 20.95,7.75 v18.92,5.71
N$20
  Top 0.254: IC8.13 48.82,29.92 49.28,29.46 49.28,26 LD3.C
N$21
  Top 0.254: IC8.12 48.2,29.27 48.64,28.83 48.64,27.05 47.75,26.16 47.37,26.16 46.36,25.15 45.89,25.15 LD4.C 45.76,25.02
N$22
  Top 0.254: IC8.11 47.2,28.62 47.5,28.32 47.5,27.05 47.12,26.67 44.87,26.67 LD5.C
N$23
  Top 0.254: C11.1 53.34,8.88 X3.1 52.7,9.59 52.7,11.81 52.32,12.19 48.01,12.19 47.75,11.94 47.75,10.03 47.24,9.53 IC4.2
N$24
  Top 0.254: IC8.10 43.63,27.97 LD7.C
N$25
  Top 0.254: R16.1 LD7.A
RESET  (via drill 0.5)
  Top 0.254: IC1.4 24.84,33.35 v26.16,34.67
  Bottom 0.254: v26.16,34.67 25.78,35.05 16.43,35.05 JP4.1
SCK
  Top 0.254: IC1.3 21.6,34.15 21.21,34.54 19.56,34.54 19.18,34.16 19.18,29.77 JP4.4 14.61,26.67 13.08,28.19 13.08,36.32 13.84,37.08 18.16,37.08 20.76,39.68 IC6.4
SCK_1
  Top 0.254: IC7.4 21.02,23.82 21.34,24.13 25.91,24.13 26.29,24.51 26.29,26.05 IC1.13
SCL  (via drill 0.5)
  Top 0.254: 31.11,26.07 IC1.19 31.24,26.1 31.24,25.15 30.86,24.77 30.86,23.88 31.5,23.24 32.26,23.24 37.85,17.65 41.78,17.65 42.29,17.14 42.29,14.1 42.43,13.96 R3.1 43.18,11.3 42.67,10.79 IC4.6 v39.12,10.79
  Bottom 0.254: 58.42,12.19 58.42,11.94 58.93,11.43 61.98,11.43 62.48,11.94 62.48,20.07 JP1.2 | 58.42,12.19 J1.4 | v39.12,10.79 37.72,10.79 37.08,10.16 37.08,6.73 37.47,6.35 41.27,6.35 42.16,7.24 56.01,7.24 56.77,8 56.77,10.54 58.42,12.19
SDA  (via drill 0.5)
  Top 0.254: IC4.5 41.15,13.83 R4.1 | R4.1 40.02,13.96 39.5,14.48 39.5,16.64 39.12,17.02 37.72,17.02 32.77,21.97 v31.88,21.97 | v31.88,24.38 31.88,26.04 IC1.20 | JP2.2 56.77,21.34 56.77,14.35 57.15,13.97 59.56,13.97 60.83,12.7 J1.3 62.23,12.7 63.12,11.81 v63.12,10.92 | R4.1 39.86,13.96 v39.24,13.34
  Bottom 0.254: v31.88,21.97 v31.88,24.38 | v39.24,13.34 37.08,13.34 36.45,12.7 36.45,6.48 37.21,5.71 41.53,5.71 42.42,6.6 56.9,6.6 58.8,8.51 62.1,8.51 63.12,9.53 v63.12,10.92
SS
  Top 0.254: IC6.5 19.81,41.78 19.56,42.04 19.56,43.43 19.81,43.69 21.97,43.69 22.61,43.05 22.61,37.97 23.24,37.34 25.58,37.34 IC1.44
THERMISTOR
  Top 0.254: IC1.35 32.79,38.12 33.53,38.86 39.89,38.86 | 39.89,38.86 R9.2 | 39.89,38.86 39.89,43.07 R6.2
UART_RXD
  Top 0.254: IC3.1 25.62,9.49 25.02,8.89 20.7,8.89 18.8,10.79 18.8,25.53 19.69,26.42 21.08,26.42 21.84,27.18 21.84,28.83 22.37,29.35 IC1.9
UART_TXD  (via drill 0.5)
  Top 0.254: IC3.5 28.22,8.79 27.81,8.38 23.11,8.38 22.61,7.87 v22.61,7.37 | IC1.10 22.58,28.55 22.48,28.45 22.48,26.92 21.34,25.78 20.07,25.78 19.43,25.15 19.43,11.05 20.83,9.65 22.61,9.65 v22.86,9.91
  Bottom 0.254: v22.86,9.91 22.86,7.62 v22.61,7.37
USB_3V3  (via drill 0.5)
  Top 0.305: IC3.4 27.57,11.82 28.07,12.32 32.77,12.32 v33.78,13.34 32.77,14.35 IC3.17 v32.77,19.18
  Bottom 0.305: v33.78,13.34 C5.1 | v32.77,19.18 32.13,18.54 29.46,18.54 28.57,19.43 28.57,20.05 R1.2
USB_5V  (via drill 0.5, 0.7)
  Top 0.406: X2.VBUS 27.68,5.97 v27.05,6.6 | v28.45,15.24 30.23,15.24 30.86,15.88 30.86,17.5 IC3.20 | R11.2 R12.2 R13.2 R14.2 R16.2 38.88,19.67 v38.1,20.45
  Bottom 0.254: C6.1 27.29,13.19
  Bottom 0.406: v27.05,6.6 27.05,11.29 C7.1 27.19,13.23 C6.1 | C6.1 27.29,14.08 v28.45,15.24 28.57,15.11 36.83,15.11 38.1,16.38 v38.1,20.45 | C6.1 26.82,13.81 IC2.3 23.86,14.09 23.74,14.09 22.86,13.21 20.97,13.21 C1.1 R15.2
VCC_3V3  (via drill 0.5, 0.6)
  Top 0.305: R4.2 41.27,16.26 v40.89,16.64 | v45.34,16.64 45.34,15.51 R2.2 45.35,14.99 45.72,14.99 46.1,14.61 46.1,14.1 46.34,13.86 C8.1 47,13.84 52.96,13.84 56.64,10.16 J1.2 | v43.18,16.64 R3.2 | IC4.8 40.89,8 v38.73,8 37.85,8.89 37.85,15.75 32.64,20.95 30.99,20.95 29.59,22.35 v29.59,22.99 IC1.17 v29.59,28.19 | IC7.5 21.02,19.61 v21.21,19.43 | v33.02,31.5 33.15,31.5 33.66,30.99 35.15,30.99 IC1.27 36.41,30.95 37.34,31.88 37.34,36.32 38.35,37.34 39.89,37.34 R9.1 40.02,37.47 v42.04,37.47 | v26.04,32.51 24.03,32.51 IC1.5 | v30.48,35.18 30.48,37.26 IC1.38 30.35,37.39 30.35,38.86 30.1,39.12 v29.97,39.12 | IC6.3 18.36,40.32 v19.05,39.62 | SENS-1.1 24.69,40.59 v24.77,40.51 | v51.94,35.56 IC5.1
  Bottom 0.305: 24.88,17.78 24.88,16.71 IC2.2 | 24.88,17.78 C2.1 24.88,20.86 C16.1 24.78,22.49 25.27,22.99 v29.59,22.99 | v45.34,16.64 v43.18,16.64 v40.89,16.64 40.89,10.16 v38.73,8 | 24.88,17.78 24.63,18.03 21.72,18.03 21.21,18.54 v21.21,19.43 16.64,19.43 16.08,19.99 JP4.6 | v29.59,28.19 29.59,29.07 C14.1 30.36,30.36 30.73,30.73 31.37,30.73 31.62,30.99 31.62,31.61 C13.1 | C13.1 31.77,32.5 31.62,32.64 31.24,32.64 30.86,33.02 30.86,33.26 C12.1 | C13.1 32.77,31.75 v33.02,31.5 | C12.1 27.18,33.66 v26.04,32.51 | C12.1 30.46,35.16 v30.48,35.18 | C15.1 18.02,39.62 v19.05,39.62 19.94,40.51 v24.77,40.51 29.07,40.51 C17.1 29.2,39.89 v29.97,39.12 | 59.66,35.58 C18.1 51.96,35.58 v51.94,35.56 43.94,35.56 v42.04,37.47 | 59.66,35.58 R8.1 | 59.66,35.58 59.66,39.54 JP3.6

### Text on the board
Dimension: 2.2" | 1.9"
tPlace: Humidity | Therm1 | + | - | AD Temp | 84A | - | + | ATtiny84A | Therm 2 | TI Temp | 3244P | BB Header | RTC
bPlace: 3v3 Reg.
bNames: theWeather.system by Todd Sukolsky | Rev A | December 16, 2012